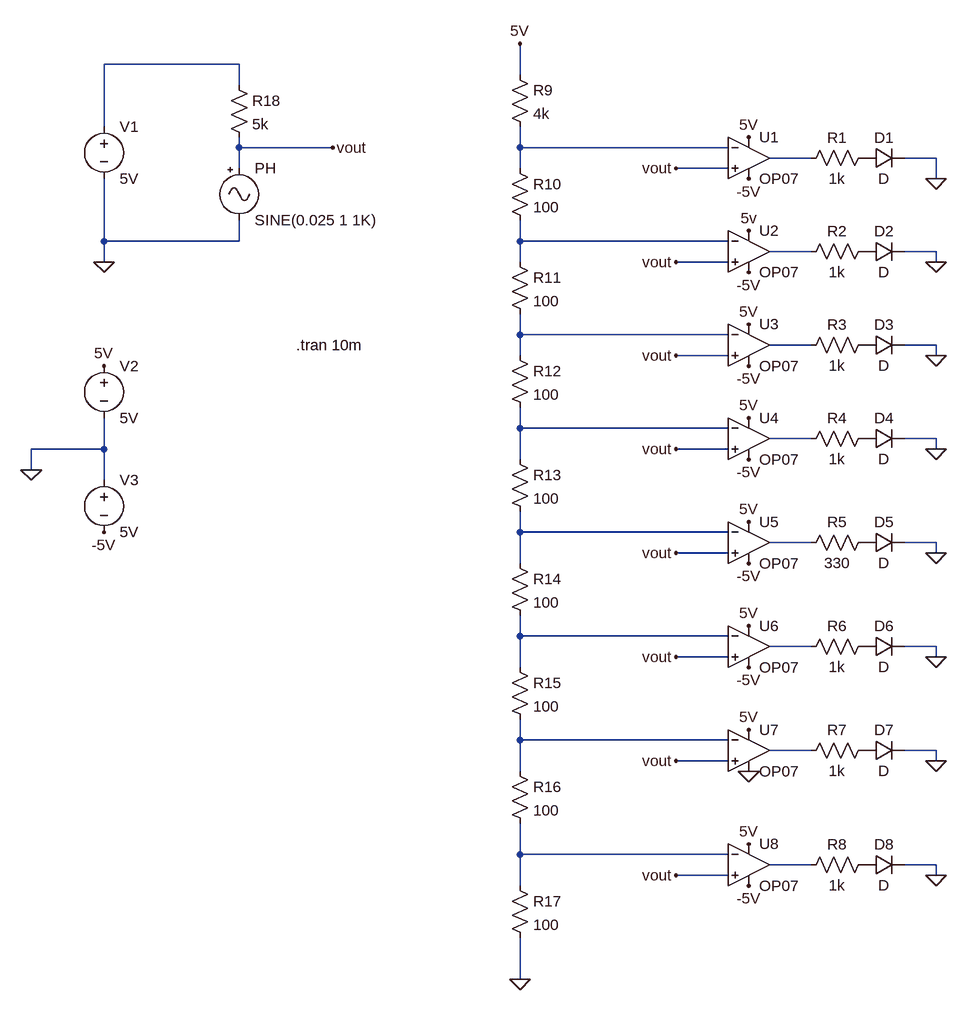
[diagram p0: schematic Project 1 - PH.asc]
Project 1 - PH.asc, the LTspice schematic file:
Version 4
SHEET 1 880 680
WIRE -240 -800 -448 -800
WIRE 192 -784 192 -832
WIRE -240 -768 -240 -800
WIRE -448 -704 -448 -800
WIRE -240 -672 -240 -688
WIRE -96 -672 -240 -672
WIRE 192 -672 192 -704
WIRE 512 -672 192 -672
WIRE 640 -656 576 -656
WIRE 832 -656 784 -656
WIRE -240 -640 -240 -672
WIRE 192 -640 192 -672
WIRE 512 -640 432 -640
WIRE 832 -624 832 -656
WIRE -448 -528 -448 -624
WIRE -240 -528 -240 -560
WIRE -240 -528 -448 -528
WIRE 192 -528 192 -560
WIRE 512 -528 192 -528
WIRE 640 -512 576 -512
WIRE 832 -512 784 -512
WIRE -448 -496 -448 -528
WIRE 192 -496 192 -528
WIRE 512 -496 432 -496
WIRE 832 -496 832 -512
WIRE 192 -384 192 -416
WIRE 512 -384 192 -384
WIRE 640 -368 576 -368
WIRE 832 -368 784 -368
WIRE 192 -352 192 -384
WIRE 512 -352 432 -352
WIRE 832 -352 832 -368
WIRE 192 -240 192 -272
WIRE 512 -240 192 -240
WIRE 640 -224 576 -224
WIRE 832 -224 784 -224
WIRE -448 -208 -448 -256
WIRE -448 -208 -560 -208
WIRE 512 -208 432 -208
WIRE 832 -208 832 -224
WIRE 192 -192 192 -240
WIRE -560 -176 -560 -208
WIRE -448 -160 -448 -208
WIRE 192 -80 192 -112
WIRE 512 -80 192 -80
WIRE 640 -64 576 -64
WIRE 832 -64 784 -64
WIRE 512 -48 432 -48
WIRE 832 -48 832 -64
WIRE 192 -32 192 -80
WIRE 192 80 192 48
WIRE 512 80 192 80
WIRE 640 96 576 96
WIRE 832 96 784 96
WIRE 512 112 432 112
WIRE 832 112 832 96
WIRE 192 128 192 80
WIRE 192 240 192 208
WIRE 512 240 192 240
WIRE 640 256 576 256
WIRE 832 256 784 256
WIRE 512 272 432 272
WIRE 832 272 832 256
WIRE 192 288 192 240
WIRE 192 416 192 368
WIRE 512 416 192 416
WIRE 640 432 576 432
WIRE 832 432 784 432
WIRE 512 448 432 448
WIRE 832 448 832 432
WIRE 192 464 192 416
WIRE 192 608 192 544
FLAG 832 -624 0
FLAG 832 -496 0
FLAG 832 -352 0
FLAG 832 -208 0
FLAG 832 -48 0
FLAG 832 112 0
FLAG 832 272 0
FLAG 832 448 0
FLAG 192 608 0
FLAG 192 -832 5V
FLAG 544 -688 5V
FLAG 544 -544 5v
FLAG 544 -400 5V
FLAG 544 -256 5V
FLAG 544 -96 5V
FLAG 544 64 5V
FLAG 544 224 5V
FLAG 544 400 5V
FLAG 544 -624 -5V
FLAG 544 -480 -5V
FLAG 544 -336 -5V
FLAG 544 -192 -5V
FLAG 544 -32 -5V
FLAG 544 128 -5V
FLAG 544 288 0
FLAG 544 464 -5V
FLAG 432 -640 vout
FLAG -448 -496 0
FLAG -448 -336 5V
FLAG -448 -80 -5V
FLAG -560 -176 0
FLAG 432 -496 vout
FLAG 432 -352 vout
FLAG 432 -208 vout
FLAG 432 -48 vout
FLAG 432 112 vout
FLAG 432 272 vout
FLAG 432 448 vout
FLAG -96 -672 vout
SYMBOL OpAmps\\OP07 544 -720 R0
SYMATTR InstName U1
SYMBOL OpAmps\\OP07 544 -576 R0
SYMATTR InstName U2
SYMBOL OpAmps\\OP07 544 -432 R0
SYMATTR InstName U3
SYMBOL OpAmps\\OP07 544 -288 R0
SYMATTR InstName U4
SYMBOL OpAmps\\OP07 544 -128 R0
SYMATTR InstName U5
SYMBOL OpAmps\\OP07 544 32 R0
SYMATTR InstName U6
SYMBOL OpAmps\\OP07 544 192 R0
SYMATTR InstName U7
SYMBOL OpAmps\\OP07 544 368 R0
SYMATTR InstName U8
SYMBOL res 736 -672 R90
WINDOW 0 0 56 VBottom 2
WINDOW 3 32 56 VTop 2
SYMATTR InstName R1
SYMATTR Value 1k
SYMBOL res 736 -528 R90
WINDOW 0 0 56 VBottom 2
WINDOW 3 32 56 VTop 2
SYMATTR InstName R2
SYMATTR Value 1k
SYMBOL res 736 -384 R90
WINDOW 0 0 56 VBottom 2
WINDOW 3 32 56 VTop 2
SYMATTR InstName R3
SYMATTR Value 1k
SYMBOL res 736 -240 R90
WINDOW 0 0 56 VBottom 2
WINDOW 3 32 56 VTop 2
SYMATTR InstName R4
SYMATTR Value 1k
SYMBOL res 736 -80 R90
WINDOW 0 0 56 VBottom 2
WINDOW 3 32 56 VTop 2
SYMATTR InstName R5
SYMATTR Value 330
SYMBOL res 736 80 R90
WINDOW 0 0 56 VBottom 2
WINDOW 3 32 56 VTop 2
SYMATTR InstName R6
SYMATTR Value 1k
SYMBOL res 736 240 R90
WINDOW 0 0 56 VBottom 2
WINDOW 3 32 56 VTop 2
SYMATTR InstName R7
SYMATTR Value 1k
SYMBOL res 736 416 R90
WINDOW 0 0 56 VBottom 2
WINDOW 3 32 56 VTop 2
SYMATTR InstName R8
SYMATTR Value 1k
SYMBOL diode 720 -640 R270
WINDOW 0 32 32 VTop 2
WINDOW 3 0 32 VBottom 2
SYMATTR InstName D1
SYMBOL diode 720 -496 R270
WINDOW 0 32 32 VTop 2
WINDOW 3 0 32 VBottom 2
SYMATTR InstName D2
SYMBOL diode 720 -352 R270
WINDOW 0 32 32 VTop 2
WINDOW 3 0 32 VBottom 2
SYMATTR InstName D3
SYMBOL diode 720 -208 R270
WINDOW 0 32 32 VTop 2
WINDOW 3 0 32 VBottom 2
SYMATTR InstName D4
SYMBOL diode 720 -48 R270
WINDOW 0 32 32 VTop 2
WINDOW 3 0 32 VBottom 2
SYMATTR InstName D5
SYMBOL diode 720 112 R270
WINDOW 0 32 32 VTop 2
WINDOW 3 0 32 VBottom 2
SYMATTR InstName D6
SYMBOL diode 720 272 R270
WINDOW 0 32 32 VTop 2
WINDOW 3 0 32 VBottom 2
SYMATTR InstName D7
SYMBOL diode 720 448 R270
WINDOW 0 32 32 VTop 2
WINDOW 3 0 32 VBottom 2
SYMATTR InstName D8
SYMBOL res 176 -800 R0
SYMATTR InstName R9
SYMATTR Value 4k
SYMBOL res 176 -656 R0
SYMATTR InstName R10
SYMATTR Value 100
SYMBOL res 176 -512 R0
SYMATTR InstName R11
SYMATTR Value 100
SYMBOL res 176 -368 R0
SYMATTR InstName R12
SYMATTR Value 100
SYMBOL res 176 -208 R0
SYMATTR InstName R13
SYMATTR Value 100
SYMBOL res 176 -48 R0
SYMATTR InstName R14
SYMATTR Value 100
SYMBOL res 176 112 R0
SYMATTR InstName R15
SYMATTR Value 100
SYMBOL res 176 272 R0
SYMATTR InstName R16
SYMATTR Value 100
SYMBOL res 176 448 R0
SYMATTR InstName R17
SYMATTR Value 100
SYMBOL voltage -448 -720 R0
WINDOW 123 24 44 Left 2
WINDOW 39 0 0 Left 0
SYMATTR InstName V1
SYMATTR Value 5V
SYMBOL res -256 -784 R0
SYMATTR InstName R18
SYMATTR Value 5k
SYMBOL voltage -448 -352 R0
WINDOW 123 24 44 Left 2
WINDOW 39 0 0 Left 0
SYMATTR InstName V2
SYMATTR Value 5V
SYMBOL voltage -448 -176 R0
WINDOW 123 24 44 Left 2
WINDOW 39 0 0 Left 0
SYMATTR InstName V3
SYMATTR Value 5V
SYMBOL Misc\\signal -240 -656 R0
SYMATTR InstName PH
SYMATTR Value SINE(0.025 1 1K)
TEXT -152 -368 Left 2 !.tran 10m

The netlist it stands for:
* Project 1 - PH.asc
XU1 vout N002 5V -5V N003 LT1001  ; OP07, pins In+ In- V+ V- OUT
XU2 vout N004 5V -5V N005 LT1001  ; OP07, pins In+ In- V+ V- OUT
XU3 vout N006 5V -5V N007 LT1001  ; OP07, pins In+ In- V+ V- OUT
XU4 vout N008 5V -5V N009 LT1001  ; OP07, pins In+ In- V+ V- OUT
XU5 vout N010 5V -5V N011 LT1001  ; OP07, pins In+ In- V+ V- OUT
XU6 vout N012 5V -5V N013 LT1001  ; OP07, pins In+ In- V+ V- OUT
XU7 vout N014 5V 0 N015 LT1001  ; OP07, pins In+ In- V+ V- OUT
XU8 vout N016 5V -5V N017 LT1001  ; OP07, pins In+ In- V+ V- OUT
R1 P001 N003 1k
R2 P002 N005 1k
R3 P003 N007 1k
R4 P004 N009 1k
R5 P005 N011 330
R6 P006 N013 1k
R7 P007 N015 1k
R8 P008 N017 1k
D1 P001 0 D
D2 P002 0 D
D3 P003 0 D
D4 P004 0 D
D5 P005 0 D
D6 P006 0 D
D7 P007 0 D
D8 P008 0 D
R9 5V N002 4k
R10 N002 N004 100
R11 N004 N006 100
R12 N006 N008 100
R13 N008 N010 100
R14 N010 N012 100
R15 N012 N014 100
R16 N014 N016 100
R17 N016 0 100
V1 N001 0 5V
R18 N001 vout 5k
V2 5V 0 5V
V3 0 -5V 5V
V§PH vout 0 SINE(0.025 1 1K)
.model D D
.lib standard.dio
.tran 10m
.lib LTC.lib
.backanno
.end